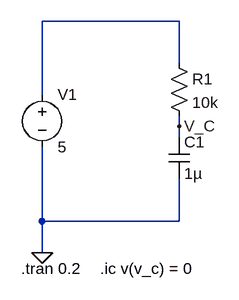
[diagram p0: schematic T2_3_RC_trans.asc]
T2_3_RC_trans.asc, the LTspice schematic file:
Version 4
SHEET 1 880 680
WIRE 352 -32 144 -32
WIRE 352 32 352 -32
WIRE 144 80 144 -32
WIRE 352 128 352 112
WIRE 352 144 352 128
WIRE 144 272 144 160
WIRE 352 272 352 208
WIRE 352 272 144 272
WIRE 144 320 144 272
FLAG 144 320 0
FLAG 352 128 V_C
SYMBOL voltage 144 64 R0
WINDOW 123 0 0 Left 0
WINDOW 39 0 0 Left 0
SYMATTR InstName V1
SYMATTR Value 5
SYMBOL cap 336 144 R0
SYMATTR InstName C1
SYMATTR Value 1µ
SYMBOL res 336 16 R0
SYMATTR InstName R1
SYMATTR Value 10k
TEXT 112 344 Left 2 !.tran 0.2
TEXT 232 344 Left 2 !.ic v(v_c) = 0

The netlist it stands for:
* T2_3_RC_trans.asc
V1 N001 0 5
C1 V_C 0 1µ
R1 N001 V_C 10k
.tran 0.2
.ic v(v_c) = 0
.backanno
.end

* Results of the author's LTspice run, read from the files saved beside the schematic
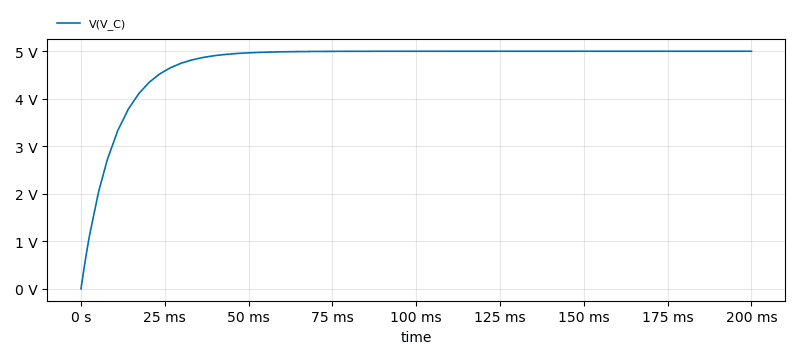
[diagram p1: Transient Analysis of T2_3_RC_trans.asc, plotted from the saved traces]
* Transient Analysis, 1 run:
*   V(V_C): min 0 V, max 5 V, average 4.749 V, rms 4.808 V, last 5 V